# EAGLE design untitled (EAGLE 9.2.2)
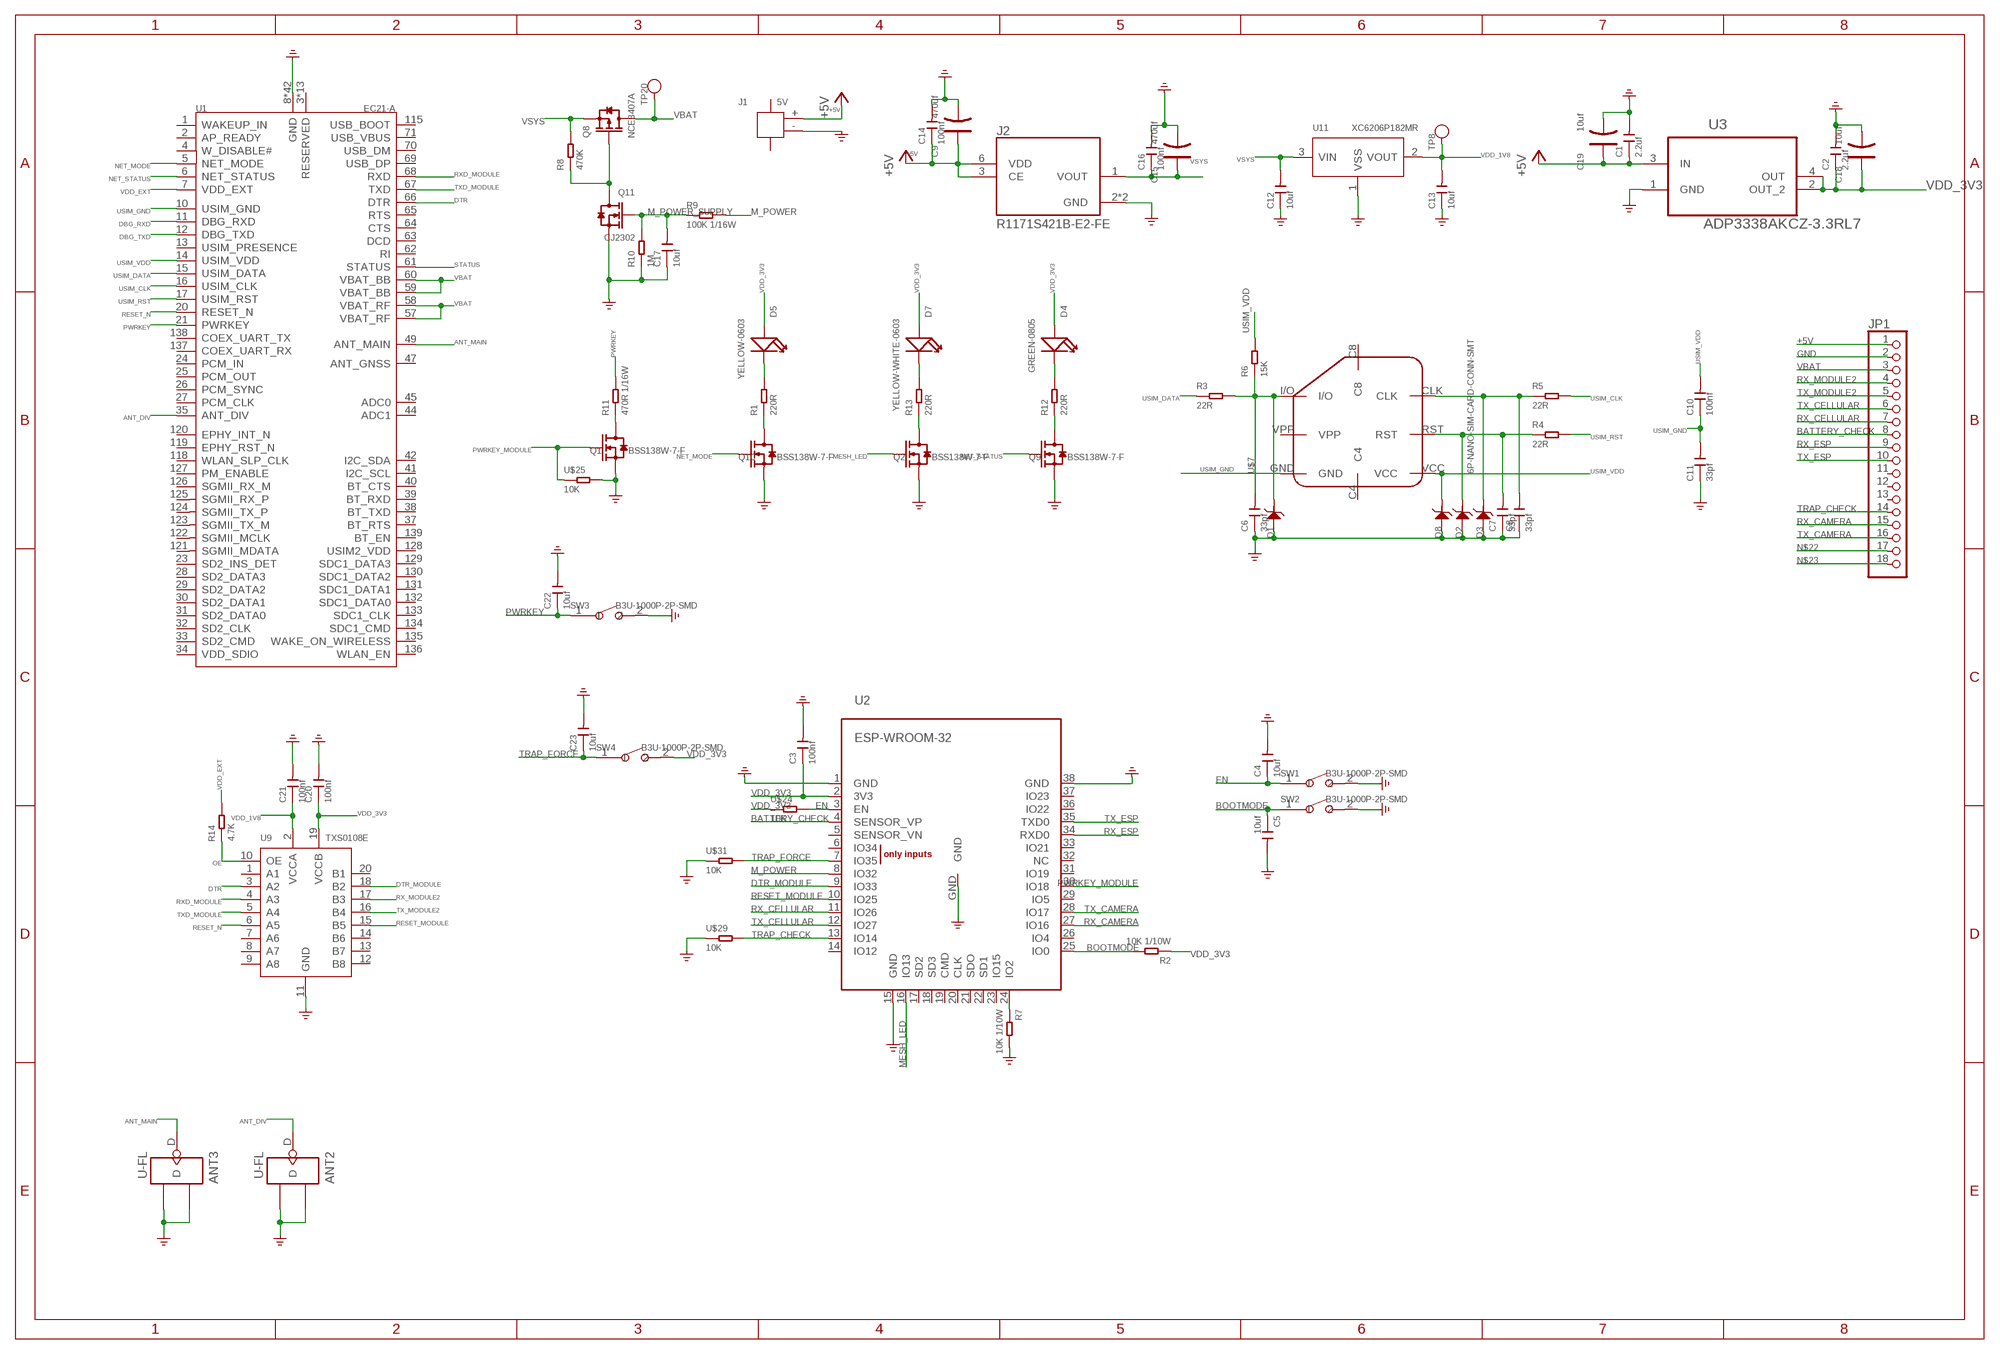
[diagram p0: schematic, sheet 1]

## Parts
ANT2  U-FL  ANTENNA-CONN-U-FL(3P)  [U-FL3P-SMD-2.6X2.6X1.0MM]
ANT3  U-FL  ANTENNA-CONN-U-FL(3P)  [U-FL3P-SMD-2.6X2.6X1.0MM]
C1  2.2uf  CERAMIC-2.2UF-10V-10%-X7R(0603)  [C0603]
C2  2.2uf  CERAMIC-2.2UF-10V-10%-X7R(0603)  [C0603]
C3  100nf  CERAMIC-100NF-25V-10%-X7R(0402)  [C0402]
C4  10uf  CERAMIC-10UF-10V-10%-X5R(0603)  [C0603]
C5  10uf  CERAMIC-10UF-10V-10%-X5R(0603)  [C0603]
C6  33pf  CERAMIC-33PF-50V-5%-NPO(0402)  [C0402]
C7  33pf  CERAMIC-33PF-50V-5%-NPO(0402)  [C0402]
C8  33pf  CERAMIC-33PF-50V-5%-NPO(0402)  [C0402]
C9  470uf  TANTALUM-SMD-470UF-6.3V(AVX-D)  [AVX-D]
C10  100nf  CERAMIC-100NF-25V-10%-X7R(0402)  [C0402]
C11  33pf  CERAMIC-33PF-50V-5%-NPO(0402)  [C0402]
C12  10uf  CERAMIC-10UF-10V-10%-X5R(0603)  [C0603]
C13  10uf  CERAMIC-10UF-10V-10%-X5R(0603)  [C0603]
C14  100nf  CERAMIC-100NF-25V-10%-X7R(0402)  [C0402]
C15  470uf  TANTALUM-SMD-470UF-6.3V(AVX-D)  [AVX-D]
C16  100nf  CERAMIC-100NF-25V-10%-X7R(0402)  [C0402]
C17  10uf  CERAMIC-10UF-6.3V-20%-X5R(0402)  [C0402]
C18  10uf  TANTALUM-SMD-10UF-10V-10%(AVX-A)  [AVX-A]
C19  10uf  TANTALUM-SMD-10UF-10V-10%(AVX-A)  [AVX-A]
C20  100nf  CERAMIC-100NF-25V-10%-X7R(0402)  [C0402]
C21  100nf  CERAMIC-100NF-25V-10%-X7R(0402)  [C0402]
C22  10uf  CERAMIC-10UF-10V-10%-X5R(0603)  [C0603]
C23  10uf  CERAMIC-10UF-10V-10%-X5R(0603)  [C0603]
D1  ESD;DF2S6.8FS  D-ESD-2P'DF2S6.8FS'  [SOD-923]
D2  ESD;DF2S6.8FS  D-ESD-2P'DF2S6.8FS'  [SOD-923]
D3  ESD;DF2S6.8FS  D-ESD-2P'DF2S6.8FS'  [SOD-923]
D4  GREEN-0805  SMD-LED-CLEAR-GREEN(0805)  [LED-0805]
D5  YELLOW-0603  SMD-LED-CLEAR-YELLOW(0603)  [LED-0603]
D7  YELLOW-WHITE-0603  SMD-LED-YELLOW-WHITE(0603)  [LED-0603]
D8  ESD;DF2S6.8FS  D-ESD-2P'DF2S6.8FS'  [SOD-923]
J1  5V  CONN-HEADER-SMD-PH-SIDE-(2P-2.0MM)  [HW2-SMD-2.0-90D]
J2  R1171S421B-E2-FE  [REG_R1171S421B-E2-FE]
JP1  HEADER-1X18  [1X18_ROUND70]
Q1  BSS138W-7-F  SMD-MOSFET-N-CH-50V-200MA-BSS138W-7-F(SOT-23)  [SOT-23]
Q2  BSS138W-7-F  SMD-MOSFET-N-CH-50V-200MA-BSS138W-7-F(SOT-23)  [SOT-23]
Q8  NCE3407A  SMD-MOSFET-P-CH-VDC=30V-ID=4.3A-NCE3407A(SOT-23)  [SOT-23]
Q9  BSS138W-7-F  SMD-MOSFET-N-CH-50V-200MA-BSS138W-7-F(SOT-23)  [SOT-23]
Q10  BSS138W-7-F  SMD-MOSFET-N-CH-50V-200MA-BSS138W-7-F(SOT-23)  [SOT-23]
Q11  CJ2302  SMD-MOSFET-N-CH-20V-2.1A-CJ2302(SOT-23)  [SOT-23]
R1  220R  SMD-RES-220R-5%-1/10W(0603)  [R0603]
R2  10K 1/10W  SMD-RES-10K-5%-1/10W(0603)  [R0603]
R3  22R  SMD-RES-22R-5%-1/10W(0603)  [R0603]
R4  22R  SMD-RES-22R-5%-1/10W(0603)  [R0603]
R5  22R  SMD-RES-22R-5%-1/10W(0603)  [R0603]
R6  15K  SMD-RES-15K-5%-1/10W(0603)  [R0603]
R7  10K 1/10W  SMD-RES-10K-5%-1/10W(0603)  [R0603]
R8  470K  SMD-RES-470K-1%-1/16W(0402)  [R0402]
R9  100K 1/16W  SMD-RES-100K-5%-1/16W(0402)  [R0402]
R10  1M  SMD-RES-1M-5%-1/16W(0402)  [R0402]
R11  470R 1/16W  SMD-RES-470R-5%-1/16W(0402)  [R0402]
R12  220R  SMD-RES-220R-5%-1/10W(0603)  [R0603]
R13  220R  SMD-RES-220R-5%-1/10W(0603)  [R0603]
R14  4.7K  SMD-RES-4.7K-5%-1/16W(0402)  [R0402]
SW1  B3U-1000P-2P-SMD  SMD-BUTTON(2P-3.0X2.5X1.2+0.4MM)-B3U-1000P-2P-SMD  [SW2-2.6-3.0X2.5X1.2+0.4MM]
SW2  B3U-1000P-2P-SMD  SMD-BUTTON(2P-3.0X2.5X1.2+0.4MM)-B3U-1000P-2P-SMD  [SW2-2.6-3.0X2.5X1.2+0.4MM]
SW3  B3U-1000P-2P-SMD  SMD-BUTTON(2P-3.0X2.5X1.2+0.4MM)-B3U-1000P-2P-SMD  [SW2-2.6-3.0X2.5X1.2+0.4MM]
SW4  B3U-1000P-2P-SMD  SMD-BUTTON(2P-3.0X2.5X1.2+0.4MM)-B3U-1000P-2P-SMD  [SW2-2.6-3.0X2.5X1.2+0.4MM]
TP8  TEST-POINT'4545'  [TP-D45MIL]
TP20  TEST-POINT'4545'  [TP-D45MIL]
U1  EC21-A  MOUDLE-LTE-EC21  [MODULE144P-1.3-32X29X2.4MM]
U2  ESP-WROOM-32  [ESP-WROOM-32]
U3  ADP3338AKCZ-3.3RL7  [SOT230P700X180-4N]
U9  TXS0108E  LOGIC-TXS0108EPWR  [TSSOP20-0.65-6.5X4.4MM]
U11  XC6206P182MR  PMIC-XC6206PMR  [SOT-23]
U$7  6P-NANO-SIM-CARD-CONN-SMT  [6PIN-NANO-SIM-SMT]
U$24  10K  SMD-RES-10K-5%-1/(0402)  [R0402]
U$25  10K  SMD-RES-10K-5%-1/(0402)  [R0402]
U$29  10K  SMD-RES-10K-5%-1/(0402)  [R0402]
U$31  10K  SMD-RES-10K-5%-1/(0402)  [R0402]

## Nets
+5V: C1.1 C9.+ C14.1 C19.+ J1.+ J2.3(CE) J2.6(VDD) JP1.1 U3.3(IN)
ANT_DIV: ANT2.D U1.35(ANT_DIV)
ANT_MAIN: ANT3.D U1.49(ANT_MAIN)
BATTERY_CHECK: JP1.8 U2.4(SENSOR_VP)
BOOTMODE: C5.1 R2.2 SW2.1 U2.25(IO0)
DBG_RXD: U1.11(DBG_RXD)
DBG_TXD: U1.12(DBG_TXD)
DTR: U1.66(DTR) U9.3(A2)
DTR_MODULE: U2.9(IO33) U9.18(B2)
EN: C4.1 SW1.1 U2.3(EN) U$24.2
GND: ANT2.GND1 ANT2.GND2 ANT3.GND1 ANT3.GND2 C1.2 C2.2 C3.2 C4.2 C5.2 C6.1 C7.1 C8.1 C9.- C11.1 C12.1 C13.1 C14.2 C15.- C16.2 C17.1 C18.- C19.- C20.2 C21.2 C22.2 C23.2 D1.2 D2.2 D3.2 D8.2 J1.- J2.2(GND) J2.5(GND) JP1.2 Q1.2(S) Q2.2(S) Q9.2(S) Q10.2(S) Q11.2(S) R7.2 R10.1 SW1.2 SW2.2 SW3.2 U1.8(GND) U1.9(GND) U1.19(GND) U1.22(GND) U1.36(GND) U1.46(GND) U1.48(GND) U1.50(GND) U1.51(GND) U1.52(GND) U1.53(GND) U1.54(GND) U1.56(GND) U1.72(GND) U1.85(GND) U1.86(GND) U1.87(GND) U1.88(GND) U1.89(GND) U1.90(GND) U1.91(GND) U1.92(GND) U1.93(GND) U1.94(GND) U1.95(GND) U1.96(GND) U1.97(GND) U1.98(GND) U1.99(GND) U1.100(GND) U1.101(GND) U1.102(GND) U1.103(GND) U1.104(GND) U1.105(GND) U1.106(GND) U1.107(GND) U1.108(GND) U1.109(GND) U1.110(GND) U1.111(GND) U1.112(GND) U2.1(GND) U2.15(GND) U2.38(GND) U2.GND U3.1(GND) U9.11(GND) U11.1(VSS) U$25.2 U$29.1 U$31.1 ; supply symbol labelled GND_POWER
M_POWER: R9.2 U2.8(IO32)
M_POWER_SUPPLY: C17.2 Q11.1(G) R9.1 R10.2
MESH_LED: Q2.1(G) U2.16(IO13)
N$1: C8.2 D3.1 R5.1 U$7.CLK
N$2: C7.2 D2.1 R4.1 U$7.RST
N$3: Q10.3(D) R1.1
N$4: C6.2 D1.1 R3.2 R6.1 U$7.I/O
N$5: Q1.3(D) R11.1
N$6: D5.- R1.2
N$7: R7.1 U2.24(IO2)
N$8: Q9.3(D) R12.1
N$9: D4.- R12.2
N$10: Q2.3(D) R13.1
N$11: D7.- R13.2
N$22: JP1.17
N$23: JP1.18
N$25: Q8.1(G) Q11.3(D) R8.1
NET_MODE: Q10.1(G) U1.5(NET_MODE)
NET_STATUS: Q9.1(G) U1.6(NET_STATUS)
OE: R14.1 U9.10(OE)
PWRKEY: C22.1 R11.2 SW3.1 U1.21(PWRKEY)
PWRKEY_MODULE: Q1.1(G) U2.30(IO18) U$25.1
RESET_MODULE: U2.10(IO25) U9.15(B5)
RESET_N: U1.20(RESET_N) U9.6(A5)
RX_CAMERA: JP1.15 U2.27(IO16)
RX_CELLULAR: JP1.7 U2.11(IO26)
RX_ESP: JP1.9 U2.34(RXD0)
RX_MODULE2: JP1.4 U9.17(B3)
RXD_MODULE: U1.68(RXD) U9.4(A3)
STATUS: U1.61(STATUS)
TRAP_CHECK: JP1.14 U2.13(IO14) U$29.2
TRAP_FORCE: C23.1 SW4.1 U2.7(IO35) U$31.2
TX_CAMERA: JP1.16 U2.28(IO17)
TX_CELLULAR: JP1.6 U2.12(IO27)
TX_ESP: JP1.10 U2.35(TXD0)
TX_MODULE2: JP1.5 U9.16(B4)
TXD_MODULE: U1.67(TXD) U9.5(A4)
USIM_CLK: R5.2 U1.16(USIM_CLK)
USIM_DATA: R3.1 U1.15(USIM_DATA)
USIM_GND: C10.1 C11.2 U1.10(USIM_GND) U$7.GND
USIM_RST: R4.2 U1.17(USIM_RST)
USIM_VDD: C10.2 D8.1 R6.2 U1.14(USIM_VDD) U$7.VCC
VBAT: JP1.3 Q8.3(D) TP20.T U1.57(VBAT_RF) U1.58(VBAT_RF) U1.59(VBAT_BB) U1.60(VBAT_BB)
VDD_1V8: C13.2 C21.1 TP8.T U9.2(VCCA) U11.2(VOUT)
VDD_3V3: C2.1 C3.1 C18.+ C20.1 D4.+ D5.+ D7.+ R2.1 SW4.2 U2.2(3V3) U3.2(OUT_2) U3.4(OUT) U9.19(VCCB) U$24.1
VDD_EXT: R14.2 U1.7(VDD_EXT)
VSYS: C12.2 C15.+ C16.1 J2.1(VOUT) Q8.2(S) R8.2 U11.3(VIN)
Unconnected: J1.3 J1.4 JP1.11 JP1.12 JP1.13 U1.1(WAKEUP_IN) U1.2(AP_READY) U1.3(RESERVED) U1.4(W_DISABLE#) U1.13(USIM_PRESENCE) U1.18(RESERVED) U1.23(SD2_INS_DET) U1.24(PCM_IN) U1.25(PCM_OUT) U1.26(PCM_SYNC) U1.27(PCM_CLK) U1.28(SD2_DATA3) U1.29(SD2_DATA2) U1.30(SD2_DATA1) U1.31(SD2_DATA0) U1.32(SD2_CLK) U1.33(SD2_CMD) U1.34(VDD_SDIO) U1.37(BT_RTS) U1.38(BT_TXD) U1.39(BT_RXD) U1.40(BT_CTS) U1.41(I2C_SCL) U1.42(I2C_SDA) U1.43(RESERVED) U1.44(ADC1) U1.45(ADC0) U1.47(ANT_GNSS) U1.55(RESERVED) U1.62(RI) U1.63(DCD) U1.64(CTS) U1.65(RTS) U1.69(USB_DP) U1.70(USB_DM) U1.71(USB_VBUS) U1.113(RESERVED) U1.114(RESERVED) U1.115(USB_BOOT) U1.116(RESERVED) U1.117(RESERVED) U1.118(WLAN_SLP_CLK) U1.119(EPHY_RST_N) U1.120(EPHY_INT_N) U1.121(SGMII_MDATA) U1.122(SGMII_MCLK) U1.123(SGMII_TX_M) U1.124(SGMII_TX_P) U1.125(SGMII_RX_P) U1.126(SGMII_RX_M) U1.127(PM_ENABLE) U1.128(USIM2_VDD) U1.129(SDC1_DATA3) U1.130(SDC1_DATA2) U1.131(SDC1_DATA1) U1.132(SDC1_DATA0) U1.133(SDC1_CLK) U1.134(SDC1_CMD) U1.135(WAKE_ON_WIRELESS) U1.136(WLAN_EN) U1.137(COEX_UART_RX) U1.138(COEX_UART_TX) U1.139(BT_EN) U1.140(RESERVED) U1.141(RESERVED) U1.142(RESERVED) U1.143(RESERVED) U1.144(RESERVED) U2.5(SENSOR_VN) U2.6(IO34) U2.14(IO12) U2.17(SD2) U2.18(SD3) U2.19(CMD) U2.20(CLK) U2.21(SDO) U2.22(SD1) U2.23(IO15) U2.26(IO4) U2.29(IO5) U2.31(IO19) U2.32(NC) U2.33(IO21) U2.36(IO22) U2.37(IO23) U9.1(A1) U9.7(A6) U9.8(A7) U9.9(A8) U9.12(B8) U9.13(B7) U9.14(B6) U9.20(B1) U$7.C4 U$7.C8 U$7.VPP

## Library data of the parts
ANT2 ANT3 = Seeed-Connector:ANTENNA-CONN-U-FL(3P): 320110048
C1 C2 = Seeed-Capacitor:CERAMIC-2.2UF-10V-10%-X7R(0603): 302010054; MPN: CC0603KRX7R6BB225
C3 C10 C14 C16 C20 C21 = Seeed-Capacitor:CERAMIC-100NF-25V-10%-X7R(0402): 302010024; MPN: CC0402KRX7R8BB104
C4 C5 C12 C13 C22 C23 = Seeed-Capacitor:CERAMIC-10UF-10V-10%-X5R(0603): 302010103; MPN: CC0603KRX5R6BB106
C6-C8 C11 = Seeed-Capacitor:CERAMIC-33PF-50V-5%-NPO(0402): 302010000; MPN: CC0402JRNPO9BN330
C9 C15 = Seeed-Capacitor:TANTALUM-SMD-470UF-6.3V(AVX-D): 302020027; MPN: TAJD477*006#NJ
C17 = Seeed-Capacitor:CERAMIC-10UF-6.3V-20%-X5R(0402): 302010053; MPN: CC0402MRX5R5BB106
C18 C19 = Seeed-Capacitor:TANTALUM-SMD-10UF-10V-10%(AVX-A): 302020011; MPN: TAJA106K010RNJ
D1-D3 D8 = Discrete-new:D-ESD-2P: SOD-923:304060009;SOD-123:304060001
D4 = Seeed-LED:SMD-LED-CLEAR-GREEN(0805): 304090057; MPN: 17-215SYGC/S530-E2/TR8
D5 = Seeed-LED:SMD-LED-CLEAR-YELLOW(0603): 304090044; MPN: 19-217-Y5C-AM1N1VY-3T
D7 = Seeed-LED:SMD-LED-YELLOW-WHITE(0603): 304090071; MPN: ADL-0603W
J1 = Seeed-Connector:CONN-HEADER-SMD-PH-SIDE-(2P-2.0MM): 320110026; VALUE: 2P-2.0-90D-SMD
J2 = R1171S421B-E2-FE:R1171S421B-E2-FE: R1171x SERIES, 2.0A/1.5A LDO REUGULATOR; AVAILABILITY: Unavailable; MF: Ricoh; MP: R1171S421B-E2-FE; PACKAGE: None; PRICE: None
JP1 = microbuilder:HEADER-1X18: Header 1x18
Q1 Q2 Q9 Q10 = Seeed-Transistor:SMD-MOSFET-N-CH-50V-200MA-BSS138W-7-F(SOT-23): 305030000; MPN: BSS138W-7-F
Q8 = Seeed-Transistor:SMD-MOSFET-P-CH-VDC=30V-ID=4.3A-NCE3407A(SOT-23): 305030010; MPN: NCE3407A
Q11 = Seeed-Transistor:SMD-MOSFET-N-CH-20V-2.1A-CJ2302(SOT-23): 305030015; MPN: CJ2302
R1 R12 R13 = Seeed-Resistor:SMD-RES-220R-5%-1/10W(0603): 301010163; MPN: RC0603JR-07220RL
R2 R7 = Seeed-Resistor:SMD-RES-10K-5%-1/10W(0603): 301010293; MPN: RC0603JR-0710KL
R3-R5 = Seeed-Resistor:SMD-RES-22R-5%-1/10W(0603): 301010289; MPN: RC0603JR-0722RL
R6 = Seeed-Resistor:SMD-RES-15K-5%-1/10W(0603): 301010103; MPN: RC0603JR-0715KL
R8 = Seeed-Resistor:SMD-RES-470K-1%-1/16W(0402): 301010069; MPN: RC0402FR-07470KL
R9 = Seeed-Resistor:SMD-RES-100K-5%-1/16W(0402): 301010033; MPN: RC0402JR-07100KL
R10 = Seeed-Resistor:SMD-RES-1M-5%-1/16W(0402): 301010009; MPN: RC0402JR-071ML
R11 = Seeed-Resistor:SMD-RES-470R-5%-1/16W(0402): 301010013; MPN: RC0402JR-07470RL
R14 = Seeed-Resistor:SMD-RES-4.7K-5%-1/16W(0402): 301010010; MPN: RC0402JR-074K7L
SW1-SW4 = Seeed-Switch:SMD-BUTTON(2P-3.0X2.5X1.2+0.4MM): 311020047; MPN: B3U-1000P-2P-SMD
TP8 TP20 = Discrete-new:TEST-POINT; PARTNO: DNP
U1 = moudle-new:MOUDLE-LTE-EC21
U2 = esp32:ESP-WROOM-32
U3 = ADP3338AKCZ-3.3RL7:ADP3338AKCZ-3.3RL7: Low Dropout Regulator; AVAILABILITY: Unavailable; DESCRIPTION: LDO Regulator Pos 3.3V 1.6A 4-Pin_3+Tab_ SOT-223 T/R; MF: Analog Devices; MP: ADP3338AKCZ-3.3RL7; PACKAGE: SOT-223 Analog Devices; PRICE: None
U9 = IC-new:LOGIC-TXS0108EPWR: 310050026
U11 = IC-new:PMIC-XC6206P: LOW ESR Cap.Compatible Positive Voltage Regulators
U$7 = Seeed-OPL-2017-01-connector-edward:6P-NANO-SIM-CARD-CONN-SMT: 320100008
U$24 U$25 U$29 U$31 = Seeed-Resistor:SMD-RES-10K-5%-1/(0402): 301010004; MPN: RC0402JR-0710KL

## Board
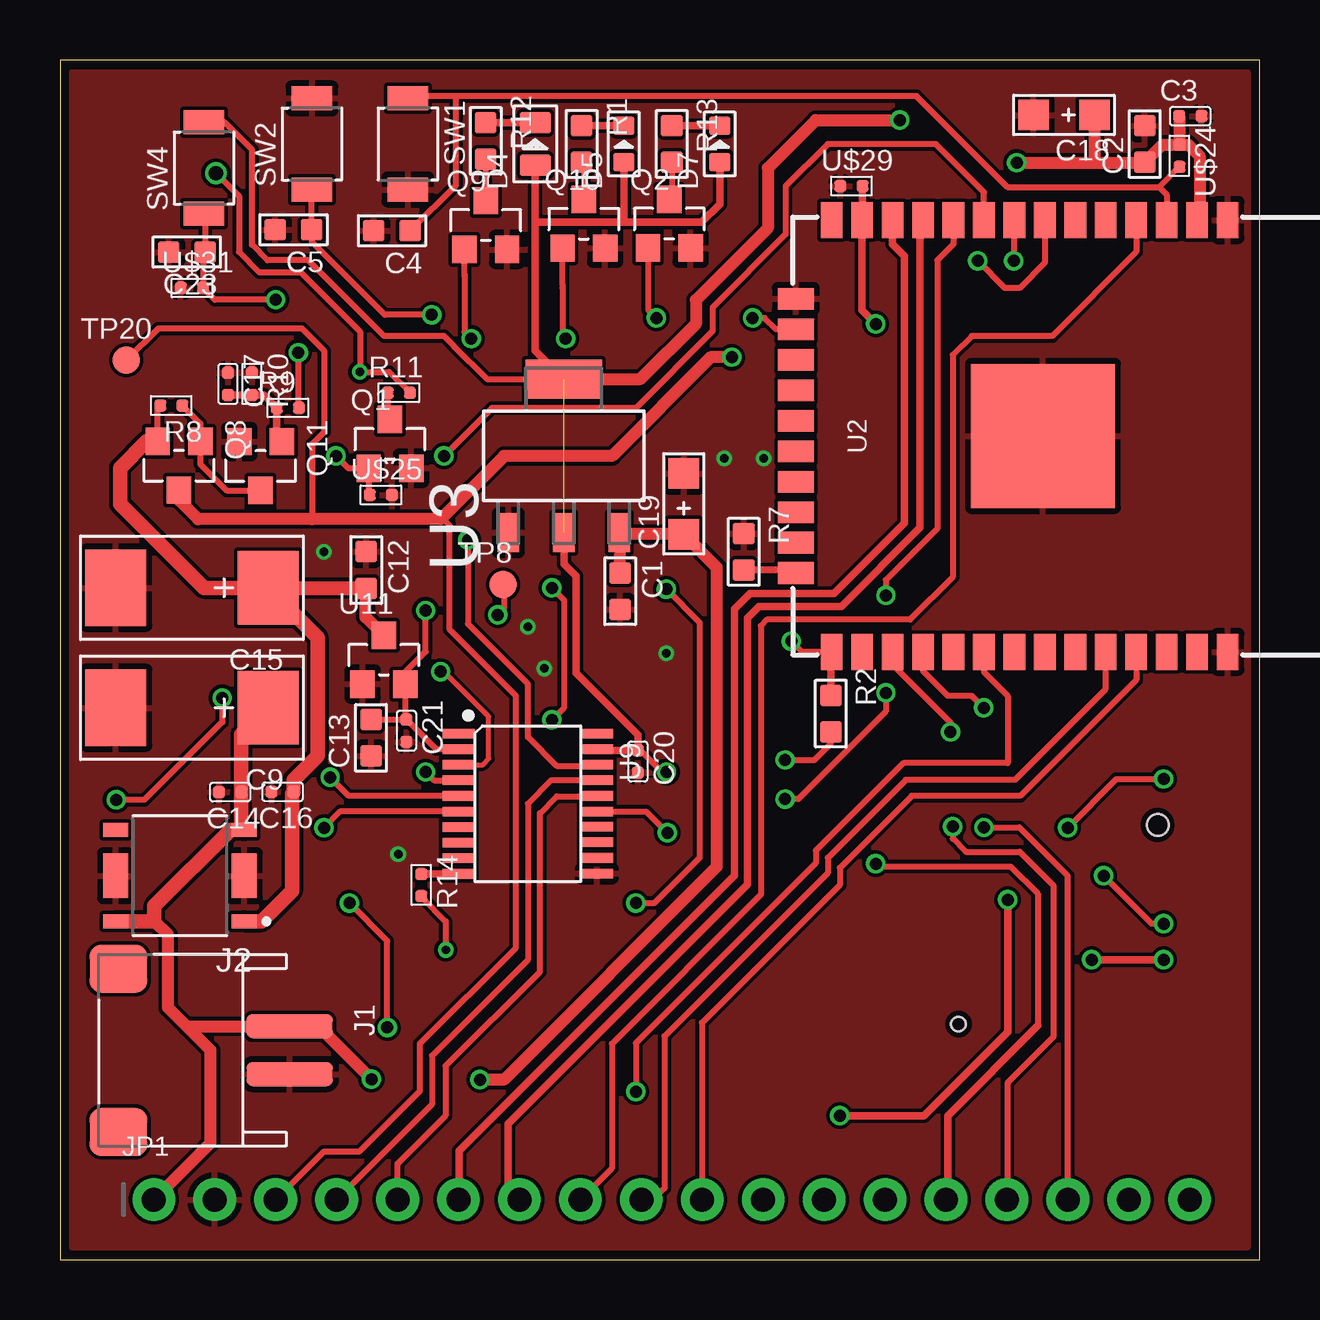
[diagram p1: board, top side]
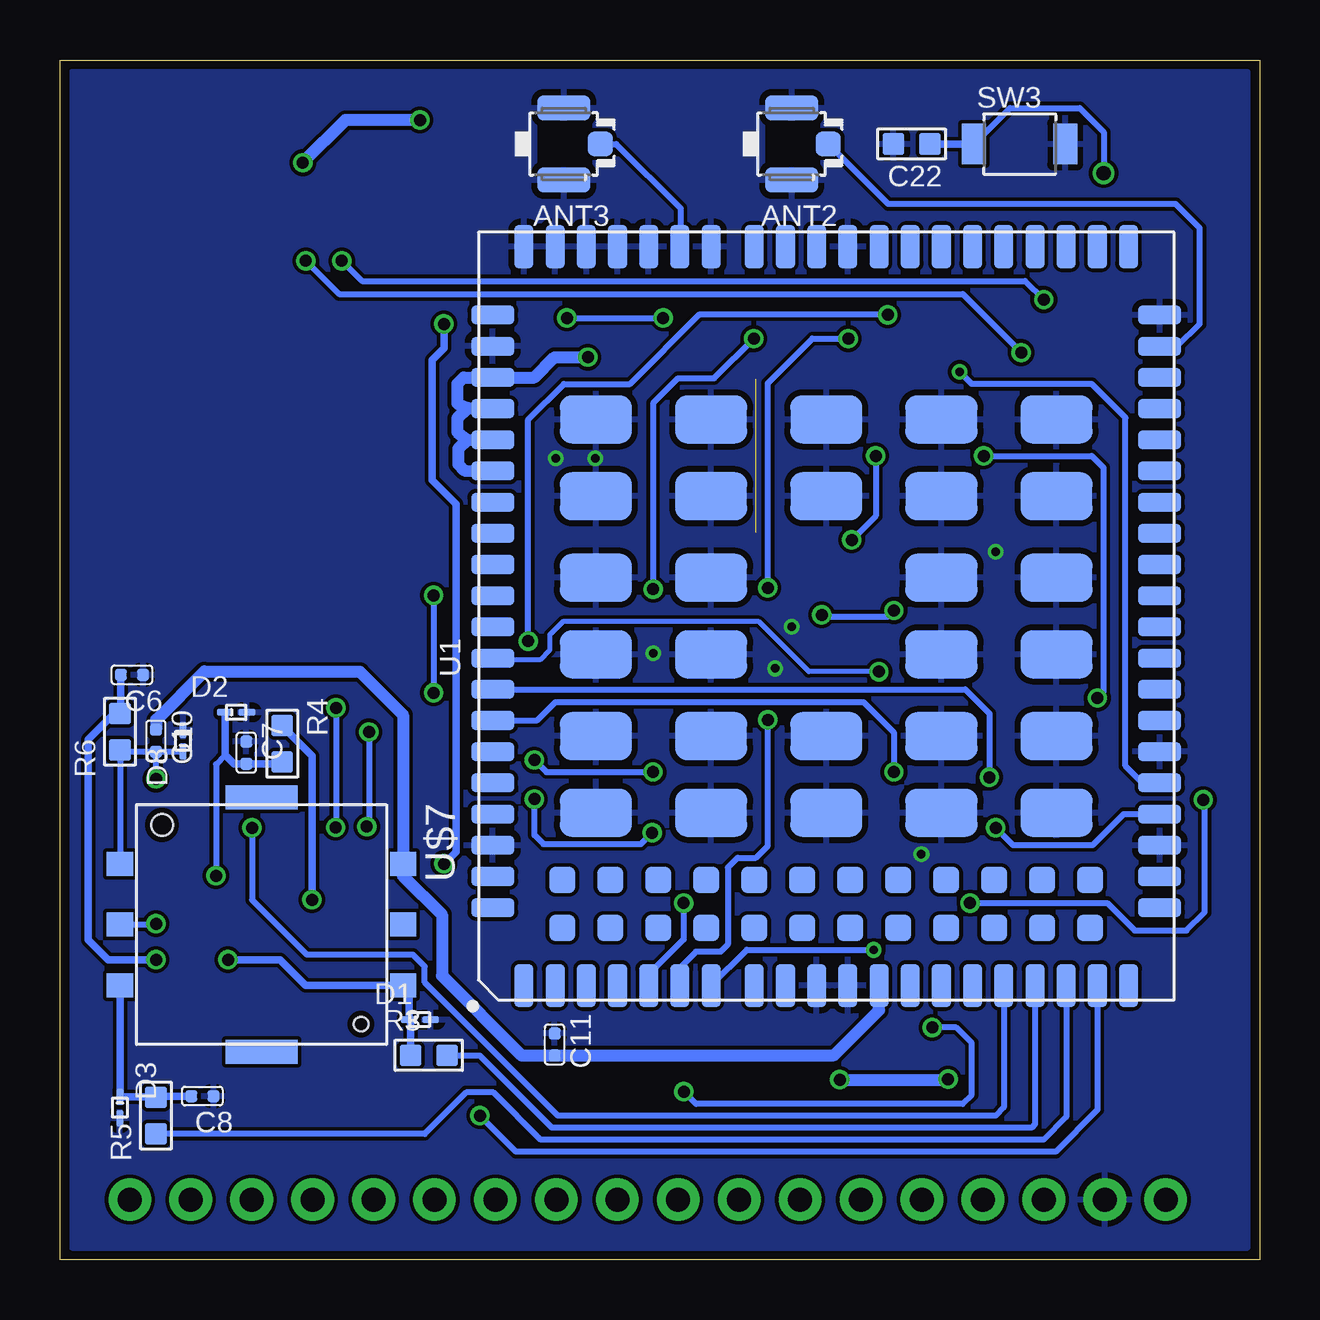
[diagram p2: board, bottom side, seen from below]

Size 50 x 50 mm. Coordinates in mm from the lower left corner, seen from the top.
Outline: 0,0 50,0 50,50 0,50 0,0
Copper layers (1*16): Top 0.035mm / dielectric 1.5mm / Bottom 0.035mm
Design rules "SeeedStudio_2layer_DRU_no_angle_20140221": minimum track width 6mil, minimum drill 12mil, track to track 6mil, track to pad 6mil, pad to pad 6mil, via to via 6mil, smd to smd 0mil, copper to edge 10mil, drill to drill 10mil, minimum pad ring 10mil, minimum via ring 6mil, stop-mask expansion 2mil, vias tented up to drill 100mil, thermal gap 10mil

### Footprints (pad centres in the part's own frame; a part is rotated, then mirrored left to right if it is on the bottom)
U-FL3P-SMD-2.6X2.6X1.0MM = smd 1.05 x 1: D -1.524,0 | smd 2.2 x 1.05: GND1 0,1.5; GND2 0,-1.5
C0603 = smd 0.889 x 0.889: 1 0,0.762; 2 0,-0.762
C0402 = smd 0.5 x 0.5: 1 0,0.463; 2 0,-0.463
AVX-D = smd 2.54 x 3.048: + -3.175,0 | smd 2.54 x 3.175: - 3.175,0
AVX-A = smd 1.27 x 1.27: + -1.27,0; - 1.27,0
SOD-923 = smd 0.7 x 0.3: 1 -0.45,0; 2 0.45,0
LED-0805 = smd 0.889 x 1.27: + -0.889,0; - 0.889,0
LED-0603 = smd 0.762 x 0.889: + -0.762,0; - 0.762,0
HW2-SMD-2.0-90D = smd 2 x 2.4: 3 3.4,-2.181; 4 -3.4,-2.181 | smd 1 x 3.6: + -1,4.953; - 1,4.953
REG_R1171S421B-E2-FE = smd 1.05 x 0.6: 1 -2.675,1.905; 3 -2.675,-1.905; 4 2.675,-1.905; 6 2.675,1.905 | smd 1.05 x 1.87: 2 -2.675,0; 5 2.675,0
1X18_ROUND70 = drill 1 pad 1.778: 1 -21.59,0; 2 -19.05,0; 3 -16.51,0; 4 -13.97,0; 5 -11.43,0; 6 -8.89,0; 7 -6.35,0; 8 -3.81,0; 9 -1.27,0; 10 1.27,0; 11 3.81,0; 12 6.35,0; 13 8.89,0; 14 11.43,0; 15 13.97,0; 16 16.51,0; 17 19.05,0; 18 21.59,0
SOT-23 = smd 1.016 x 1.143: 1 -0.889,-1.016; 2 0.889,-1.016; 3 0,1.016
R0603 = smd 0.889 x 0.889: 1 0,0.762; 2 0,-0.762
R0402 = smd 0.5 x 0.5: 1 0,0.463; 2 0,-0.463
SW2-2.6-3.0X2.5X1.2+0.4MM = smd 1 x 1.7: 1 -1.9,0; 2 1.9,0
TP-D45MIL = smd 1.143 x 1.143: T 0,0
MODULE144P-1.3-32X29X2.4MM = smd 1.8 x 0.8: 1 -15.4,12.6; 2 -15.4,11.3; 3 -15.4,10; 4 -15.4,8.7; 5 -15.4,7.4; 6 -15.4,6.1; 7 -15.4,4.8; 8 -15.4,0.4; 9 -15.4,-0.9; 10 -15.4,-2.2; 11 -15.4,-3.5; 12 -15.4,-4.8; 13 -15.4,-6.1; 14 -15.4,-7.4; 15 -15.4,-8.7; 16 -15.4,-10; 17 -15.4,-11.3; 18 -15.4,-12.6; 37 15.4,-12.6; 38 15.4,-11.3; 39 15.4,-10; 40 15.4,-8.7; 41 15.4,-7.4; 42 15.4,-6.1; 43 15.4,-4.8; 44 15.4,-3.5; 45 15.4,-2.2; 46 15.4,-0.9; 47 15.4,0.4; 48 15.4,4.8; 49 15.4,6.1; 50 15.4,7.4; 51 15.4,8.7; 52 15.4,10; 53 15.4,11.3; 54 15.4,12.6; 141 -15.4,3; 142 -15.4,1.7; 143 15.4,1.7; 144 15.4,3 | smd 0.8 x 1.8: 19 -9.55,-13.9; 20 -8.25,-13.9; 21 -6.95,-13.9; 22 -5.65,-13.9; 23 -4.35,-13.9; 24 -3.05,-13.9; 25 -1.75,-13.9; 26 -0.45,-13.9; 27 0.85,-13.9; 28 2.15,-13.9; 29 3.45,-13.9; 30 4.75,-13.9; 31 6.05,-13.9; 32 7.35,-13.9; 33 8.65,-13.9; 34 9.95,-13.9; 35 11.25,-13.9; 36 12.55,-13.9; 55 12.55,13.9; 56 11.25,13.9; 57 9.95,13.9; 58 8.65,13.9; 59 7.35,13.9; 60 6.05,13.9; 61 4.75,13.9; 62 3.45,13.9; 63 2.15,13.9; 64 0.85,13.9; 65 -0.45,13.9; 66 -1.75,13.9; 67 -3.05,13.9; 68 -4.35,13.9; 69 -5.65,13.9; 70 -6.95,13.9; 71 -8.25,13.9; 72 -9.55,13.9; 113 -10.85,13.9; 114 -12.15,13.9; 115 -10.85,-13.9; 116 -12.15,-13.9 | smd 2 x 3: 85 8.2,9.6; 86 8.2,4.8; 87 8.2,0; 88 8.2,-4.8; 89 8.2,-9.6; 90 5,9.6; 91 5,4.8; 92 5,0; 93 5,-4.8; 94 5,-9.6; 95 1.6,9.6; 96 1.6,4.8; 97 1.6,-4.8; 98 1.6,-9.6; 99 -1.6,9.6; 100 -1.6,4.8; 101 -1.6,-4.8; 102 -1.6,-9.6; 103 -5,9.6; 104 -5,4.8; 105 -5,0; 106 -5,-4.8; 107 -5,-9.6; 108 -8.2,9.6; 109 -8.2,4.8; 110 -8.2,0; 111 -8.2,-4.8; 112 -8.2,-9.6 | smd 1.1 x 1.1: 117 -11,11; 118 -11,9; 119 -11,7; 120 -11,5; 121 -11,3; 122 -11,1; 123 -11,-1; 124 -11,-3; 125 -11,-5; 126 -11,-7; 127 -11,-9; 128 -11,-11; 129 -13,11; 130 -13,9; 131 -13,7; 132 -13,5; 133 -13,3; 134 -13,1; 135 -13,-1; 136 -13,-3; 137 -13,-5; 138 -13,-7; 139 -13,-9; 140 -13,-11
ESP-WROOM-32 = smd 0.9 x 1.5: 1 7.7,9; 2 6.43,9; 3 5.16,9; 4 3.89,9; 5 2.62,9; 6 1.35,9; 7 0.08,9; 8 -1.19,9; 9 -2.46,9; 10 -3.73,9; 11 -5,9; 12 -6.27,9; 13 -7.54,9; 14 -8.81,9; 25 -8.81,-9; 26 -7.54,-9; 27 -6.27,-9; 28 -5,-9; 29 -3.73,-9; 30 -2.46,-9; 31 -1.19,-9; 32 0.08,-9; 33 1.35,-9; 34 2.62,-9; 35 3.89,-9; 36 5.16,-9; 37 6.43,-9; 38 7.7,-9 | smd 1.5 x 0.9: 15 -10.3,5.715; 16 -10.3,4.445; 17 -10.3,3.175; 18 -10.3,1.905; 19 -10.3,0.635; 20 -10.3,-0.635; 21 -10.3,-1.905; 22 -10.3,-3.175; 23 -10.3,-4.445; 24 -10.3,-5.715 | smd 6 x 6: GND 0,0
SOT230P700X180-4N = smd 1.626 x 0.889: 1 -3.2,2.311; 2 -3.2,0; 3 -3.2,-2.311 | smd 1.626 x 3.175: 4 3.2,0
TSSOP20-0.65-6.5X4.4MM = smd 0.4 x 1.35: 1 -2.925,-2.875; 2 -2.275,-2.875; 3 -1.625,-2.875; 4 -0.975,-2.875; 5 -0.325,-2.875; 6 0.325,-2.875; 7 0.975,-2.875; 8 1.625,-2.875; 9 2.275,-2.875; 10 2.925,-2.875; 11 2.91,2.875; 12 2.26,2.875; 13 1.61,2.875; 14 0.96,2.875; 15 0.325,2.875; 16 -0.325,2.875; 17 -0.975,2.875; 18 -1.625,2.875; 19 -2.275,2.875; 20 -2.925,2.875
6PIN-NANO-SIM-SMT = smd 1 x 3: C4 -2.765,5.9; C8 7.845,5.9 | smd 1 x 1.1: CLK 5.08,0; GND 0,11.8; I/O 5.08,11.8; RST 2.54,0; VCC 0,0; VPP 2.54,11.8 | hole 0.9: -1.61,1.75 | hole 0.6: 6.69,10.05

### Placement (x,y rotation side)
ANT2  19.5,46.5 180 bottom
ANT3  29,46.5 180 bottom
C1  23.35,27.86 0 top
C2  45.22,46.49 180 top
C3  47.11,47.66 90 top
C4  13.84,42.88 270 top
C5  9.73,42.93 270 top
C6  47,24.37 270 bottom
C7  42.24,21.13 0 bottom
C8  44.07,6.81 270 bottom
C9  5.5,23 180 top
C10  46,21.63 0 bottom
C11  29.39,8.96 0 bottom
C12  12.77,28.74 0 top
C13  12.96,21.75 180 top
C14  7.09,19.48 270 top
C15  5.5,28 180 top
C16  9.28,19.5 270 top
C17  7,36.5 0 top
C18  41.85,47.71 180 top
C19  26,31.5 90 top
C20  24.09,20.76 0 top
C21  14.44,22.04 0 top
C22  14.5,46.5 270 bottom
C23  5.29,42 270 top
D1  35,10 0 bottom
D2  42.66,22.81 0 bottom
D3  47.51,6.33 270 bottom
D4  19.81,46.5 90 top
D5  23.5,46.5 90 top
D7  27.5,46.5 90 top
D8  44.87,21.63 90 bottom
J1  4.62,8.72 270 top
J2  5,16 180 top
JP1  25.5,2.5 0 top
Q1  13.75,34 0 top
Q2  25.4,43.18 0 top
Q8  4.96,33.09 180 top
Q9  17.75,43.12 0 top
Q10  21.84,43.17 0 top
Q11  8.36,33.08 180 top
R1  21.75,46.5 180 top
R2  32.13,22.75 180 top
R3  34.63,8.51 270 bottom
R4  40.74,21.5 180 bottom
R5  46,6 0 bottom
R6  47.5,22 0 bottom
R7  28.5,29.5 180 top
R8  4.64,35.6 270 top
R9  9.5,35.5 90 top
R10  8,36.5 0 top
R11  14.13,36.13 90 top
R12  17.75,46.63 180 top
R13  25.5,46.5 180 top
R14  15.05,15.61 0 top
SW1  14.5,46.5 270 top
SW2  10.5,46.5 90 top
SW3  10,46.5 0 bottom
SW4  6,45.5 90 top
TP8  18.47,28.14 0 top
TP20  2.77,37.48 0 top
U1  18.06,26.82 90 bottom
U2  40.97,34.33 0 top
U3  21,33.5 90 top
U9  19.5,19 270 top
U11  13.5,25 0 top
U$7  47.5,16.5 270 bottom
U$24  46.66,46.01 0 top
U$25  13.37,31.87 90 top
U$29  32.99,44.74 90 top
U$31  5.5,40.5 90 top

### Tracks (layer width: path | path; a pad name or v marks a point on that pad's centre or on a via)
+5V  (via drill 0.5)
  Top 0.152: 23.62,30.33 U3.3 | 25.76,30.33 C19.+
  Top 0.508: 5.28,9.72 J1.+ 10.78,9.72 v12.98,7.52 | 5.28,9.72 6.28,8.72 6.28,4.87 JP1.1 | 5.28,9.72 4.5,10.5 4.5,13.53 3.94,14.1 | C1.1 23.37,30.24 | 23.37,30.24 U3.3 | v17.5,7.5 18.51,7.5 27.37,16.36 27.37,28.86 C19.+ 23.38,30.23 23.37,30.24
  Top 0.61: 9.31,9.72 J1.+ | J2.6 3.94,14.1 3.94,14.73 7.11,17.91 7.56,17.91 | 7.56,17.91 J2.3 | 7.56,17.91 C14.1 7.56,21.88 C9.+
  Bottom 0.508: v17.5,7.5 13,7.5 v12.98,7.52
ANT_DIV
  Bottom 0.254: U1.35 3.43,38.07 2.5,39 2.5,43 3.5,44 15.48,44 ANT2.D
ANT_MAIN
  Bottom 0.254: ANT3.D 26.82,46.5 24.13,43.81 24.13,42.25 U1.49
BATTERY_CHECK
  Top 0.254: JP1.8 23,3.81 23,9 29.21,15.21 29.21,26.42 29.46,26.67 35.43,26.67 37.21,28.45 37.21,37.71 38,38.5 41.36,38.5 44.86,42 U2.4
BOOTMODE  (via drill 0.5)
  Top 0.254: U2.25 30.92,25.33 v30.48,25.77 | v15.49,39.38 13.54,39.38 10.49,42.43 C5.1 SW2.1
  Top 0.305: SW2.1 | U2.25 32.13,25.3 R2.2
  Bottom 0.254: v30.48,25.77 30.48,35.02 29,36.5 26.24,36.5 23.34,39.4 15.52,39.4 v15.49,39.38
DTR  (via drill 0.5)
  Top 0.2: U9.3 17.62,20.62 17.87,20.87 17.87,22.63 16,24.5 v15.87,24.5
  Bottom 0.2: v15.87,24.5 18.79,24.5 20.87,26.59 29.04,26.59 29.59,26.04 29.59,25.41 30,25 31.89,25 arc90 U1.66
DTR_MODULE  (via drill 0.5)
  Top 0.254: U2.9 38.51,44.49 36.5,46.5 32,46.5 30.25,44.75 30.25,42.74 27.2,39.68 27.2,38.7 24,35.5 18,35.5 v16,33.5 | U9.18 22.43,20.57 20.7,20.57 19.5,21.77 19.5,24 17,26.5 v17,30
  Bottom 0.254: v16,33.5 16,31 v17,30
EN
  Top 0.254: 45.82,44.7 39.5,44.7 35.7,48.5 16.5,48.5 | U$24.2 45.82,44.7 | 45.82,44.7 46.13,44.39 U2.3 | SW1.1 14.6,48.5 16.5,48.5 | C4.1 16.5,44.78 16.5,48.5
GND  (via drill 0.35)
  Top 0.152: 38.25,31.7 40.84,34.29 U2.GND | 31.09,39.93 30.79,39.93 U2.15 | 22.25,16 U9.11 | 7.62,15.85 J2.2 | 2.29,15.85 J2.5 2.29,16 2.29,16.76 | 13.11,21.03 C13.1 | 14.17,33.22 14.39,32.98 | 5.03,40.45 U$31.1 | 6.86,37.08 C17.1 | 18.9,30.48 18.75,30.33 U3.1
  Bottom 0.152: D2.2 42.17,22.82 D2.2
  other vias: 11,29.5 19.5,26.37 25.27,25.27 20.19,24.64 29.34,33.4 27.69,33.4 14.1,16.89
  pour Top: 0.5,0.5 0.5,49.5 49.5,49.5 49.5,0.5
  pour Bottom: 0.5,0.5 0.5,49.5 49.5,49.5 49.5,0.5
M_POWER  (via drill 0.5)
  Top 0.254: v39.75,41.63 39.78,41.65 U2.8 | v9.93,37.8 9.93,35.53 R9.2
  Bottom 0.254: v9.93,37.8 12.37,40.25 38.37,40.25 v39.75,41.63
M_POWER_SUPPLY
  Top 0.305: Q11.1 9.04,34.35 R9.1 8.5,36.04 R10.2 C17.2
MESH_LED  (via drill 0.5)
  Top 0.254: U2.16 29.84,38.77 29.37,39.25 v28.87,39.25 | v24.86,39.25 24.51,39.59 Q2.1
  Bottom 0.254: v28.87,39.25 v24.86,39.25
N$1
  Bottom 0.305: 47.5,6.79 D3.1 | 47.5,6.79 U$7.CLK | 47.5,6.79 46.03,6.79 R5.1 45.95,6.81 C8.2
N$2  (via drill 0.5)
  Top 0.254: v46,14 45.5,14 v43.5,16
  Bottom 0.254: U$7.RST 46.04,13.96 v46,14 | v43.5,16 43.5,20.64 43.11,21.04
  Bottom 0.305: R4.1 40.81,20.66 C7.2 42.74,20.66 43.11,21.04 D2.1
N$3
  Top 0.254: R1.1 21.84,45.65 Q10.3
N$4  (via drill 0.5)
  Top 0.305: v46,12.5 v43,12.5
  Bottom 0.305: 47.4,22.87 R6.1 | C6.2 47.46,22.8 R6.1 | R3.2 35.4,9.95 D1.1 35.45,11.17 U$7.I/O 39.75,11.43 40.82,12.5 v43,12.5 | R6.1 47.74,22.76 48.83,21.67 48.83,13.33 48,12.5 v46,12.5
N$5
  Top 0.254: 13.54,35.23 Q1.3 13.66,35.1 R11.1
N$6
  Top 0.305: R1.2 D5.-
N$7
  Top 0.305: R7.1 30.51,28.77 U2.24
N$8
  Top 0.254: R12.1 Q9.3
N$9
  Top 0.305: R12.2 D4.-
N$10
  Top 0.254: R13.1 25.5,44.3 Q2.3
N$11
  Top 0.305: R13.2 D7.-
N$25
  Top 0.254: Q11.3 6.94,32.06 5.85,33.15 Q8.1 5.85,34.85 R8.1
NET_MODE  (via drill 0.5)
  Top 0.254: v25.27,27.94 26.66,26.55 26.66,16.75 24.77,14.86 v24,14.86 | v21.08,38.39 20.95,38.52 20.95,40.5 20.95,40.66 Q10.1
  Bottom 0.254: v25.27,27.94 25.27,35.7 24.23,36.73 22.73,36.73 v21.08,38.39 | U1.5 25.46,11.88 24,13.34 v24,14.86
NET_STATUS  (via drill 0.5)
  Top 0.254: v20.5,22.5 21,23 21,27.5 v20.5,28 | v17.14,38.39 16.86,38.67 16.86,41 16.86,41.1 Q9.1
  Bottom 0.254: v20.5,22.5 20.5,17.25 21,16.75 21.75,16.75 22.16,16.34 22.16,13.13 22.46,12.83 23.5,12.83 24.16,12.16 U1.6 | v20.5,28 20.5,36.53 18.64,38.39 v17.14,38.39
OE
  Top 0.305: R14.1 U9.10
PWRKEY  (via drill 0.35, 0.6)
  Top 0.254: R11.2 13.72,37 v12.5,37 12.5,38.68 10.03,41.15 8.31,41.15 7.46,42 7.46,44.32 v6.5,45.28
  Bottom 0.254: 4.03,20 U1.21 4.88,19.87 5.59,20.57 5.59,35.09 7,36.5 12,36.5 v12.5,37 | SW3.1 10.4,48 7.5,48 6.5,47 v6.5,45.28
  Bottom 0.305: C22.1 SW3.1
PWRKEY_MODULE  (via drill 0.5)
  Top 0.254: U2.30 38.51,24.49 39.5,23.5 39.5,20.69 35.15,20.69 31.5,17.05 31.5,16.52 24,9.02 v24,7 | v6.76,23.41 6.76,22.41 3.52,19.16 v2.34,19.16 | v13.64,9.67 13.64,13.28 v12.06,14.86 | v11.5,33.5 12.02,32.98 Q1.1 12.87,31.92 U$25.1
  Bottom 0.254: v11.5,33.5 7,33.5 6.51,33.01 6.51,23.66 v6.76,23.41 | v13.64,9.67 12.64,9.67 12,9.03 12,6.87 12.38,6.49 23.48,6.49 v24,7 | v12.06,14.86 6.35,14.86 5.21,13.72 3.05,13.72 2.29,14.48 2.29,19.11 v2.34,19.16
RESET_MODULE  (via drill 0.5)
  Top 0.254: v34.42,23.62 34.42,22.84 30.77,19.19 v30.23,19.19 | U2.10 37.24,42.33 36.56,41.65 36.56,30.47 34.42,28.33 v34.42,27.69 | U9.15 24.43,18.68 v25.32,17.79
  Bottom 0.254: v34.42,27.69 v34.42,23.62 | v30.23,19.19 30.23,17.69 29.85,17.32 25.79,17.32 v25.32,17.79
RESET_N  (via drill 0.5)
  Top 0.254: U9.6 11.68,18.68 v11,18
  Bottom 0.254: U1.20 5.66,18.57 6.96,17.27 10.27,17.27 v11,18
RX_CAMERA  (via drill 0.5)
  Top 0.254: U2.27 34.7,24.8 37.12,22.38 v37.12,21.99 | JP1.15 39.5,2.53 39.5,7.37 41.41,9.28 41.41,15.59 40,17 37.75,17 37.21,17.54 v37.21,18.04
  Bottom 0.254: v37.12,21.99 37.12,18.13 v37.21,18.04
RX_CELLULAR
  Top 0.305: U2.11 35.84,43.2 35.84,30.51 32.56,27.23 29.14,27.23 28.65,26.74 28.65,15.64 18.68,5.67 18.68,2.97 JP1.7
RX_ESP
  Top 0.254: U2.34 43.57,25.31 43.57,23.76 39.81,20 35.25,20 32,16.75 32,16.12 25.19,9.3 25.19,2.96 24.73,2.5 JP1.9
RX_MODULE2
  Top 0.254: JP1.4 15.5,6.47 15.5,8.5 19.5,12.5 19.5,19 20.48,19.98 U9.17
RXD_MODULE  (via drill 0.5)
  Top 0.254: v15.24,20.32 15.59,19.98 U9.4
  Bottom 0.254: U1.68 30.11,22.47 29.35,23.23 16.5,23.23 15.24,21.97 v15.24,20.32
TRAP_CHECK  (via drill 0.5)
  Top 0.254: v34,16.5 34.12,16.38 39.62,16.38 40.75,15.25 40.75,9.75
  Top 0.305: U$29.2 | U$29.2 33.45,43.35 U2.13 33.43,39.57 v34,39 | 40.75,9.75 37,6 37,2.57 JP1.14
  Bottom 0.305: v34,39 34,38 34.5,37.5 34.5,32.5 33.5,31.5 33.5,17 v34,16.5
TRAP_FORCE  (via drill 0.5)
  Top 0.254: SW4.1 6.05,43.55 C23.1 5.96,41.91 U$31.2 6.46,40.01 v8.99,40.01 | U2.7 41.05,41.55 40,40.5 39.38,40.5 v38.25,41.63
  Bottom 0.254: v38.25,41.63 37.41,40.79 9.77,40.79 v8.99,40.01
TX_CAMERA  (via drill 0.5)
  Top 0.254: U2.28 35.97,24.53 37,23.5 38,23.5 v38.5,23 | JP1.16 42.01,15.99 39.99,18.01 v38.51,18.01
  Bottom 0.254: v38.5,23 38.5,18.03 v38.51,18.01
TX_CELLULAR
  Top 0.305: U2.12 34.7,42.33 35.2,41.83 35.2,30.7 32.25,27.75 28.75,27.75 28.12,27.12 28.12,16.01 16.64,4.53 16.64,2.53 JP1.6
TX_ESP
  Top 0.254: U2.35 44.86,24.16 40.03,19.33 35.5,19.33 32.5,16.33 32.5,15.61 26.76,9.87 26.76,2.51 JP1.10
TX_MODULE2
  Top 0.152: U9.16 22.4,19.36 22.35,19.3
  Top 0.254: JP1.5 14.07,4 16.07,6 16.07,8.07 20,12 20,18.6 20.7,19.3 22.35,19.3
TXD_MODULE  (via drill 0.5)
  Top 0.254: U9.5 12.04,19.32 v11.26,20.1
  Bottom 0.254: U1.67 12.27,23.77 11.25,22.75 11.25,20.11 v11.26,20.1
USIM_CLK
  Bottom 0.254: U1.16 8.06,5.94 9,5 29.96,5 31.93,6.96 33.07,6.96 34.8,5.24 R5.2
  Bottom 0.305: 8.13,11.35 U1.16
USIM_DATA
  Bottom 0.254: U1.15 9.36,5.64 9.5,5.5 29.5,5.5 32.5,8.5 33.86,8.5 R3.1
USIM_GND
  Bottom 0.508: C10.1 46,22.5 43.99,24.51 43.98,24.5 37.5,24.5 35.7,22.7 U$7.GND 35.7,16 34.08,14.38 34.08,11.84 30.75,8.51 C11.2 29.37,8.52 17.74,8.52 15.86,10.39 U1.10
USIM_RST  (via drill 0.5)
  Top 0.305: v32.5,6 36,6 39.5,9.5 v39.5,15
  Bottom 0.254: U1.17 6.76,6.24 8.5,4.5 31,4.5 v32.5,6
  Bottom 0.305: R4.2 40.74,22.24 39.5,21 v39.5,15
USIM_VDD  (via drill 0.5)
  Top 0.254: v42,18 44.03,20.03 v46,20.03
  Bottom 0.254: D8.1 44.89,21.16 C10.2 | C10.2 47.43,21.16 | R6.2 U$7.VCC | U1.14 10.66,6.34 11,6 29.24,6 34.8,11.56 34.8,12.21 35.28,12.7 39.7,12.7 42,15 v42,18 | v46,20.03 C10.2
  Bottom 0.305: 47.43,21.16 R6.2
VBAT  (via drill 0.5)
  Top 0.254: JP1.3 10.99,4.5 12.47,4.5 14.99,7.02 14.99,8.99 19,13 19,23.5 16.25,26.25 16.25,30.59 15.92,30.92 | 10.5,30.86 10.5,34 11,34.5 11,37.9 10.09,38.8 4.09,38.8 TP20.T
  Top 0.508: v28,37.61 27.11,37.61 23,33.5 18.5,33.5 15.92,30.92 15.86,30.86 10.5,30.86 5.75,30.86 4.96,31.65 Q8.3
  Bottom 0.508: 33,35.5 33.44,35.69 33.44,36.5 33.17,36.77 U1.57 30.22,36.77 29.38,37.61 v28,37.61 | 33,35.5 U1.58 | 33,35.5 33.44,35.06 33.44,34.5 33.02,34.16 | 33.02,34.16 U1.59 | 33.02,34.16 33.4,33.78 33.4,33.15 33.15,32.89 U1.60
VDD_1V8  (via drill 0.5)
  Top 0.254: v15.24,27.05 15.24,25.34 14.39,24.48 U11.2 14.39,22.56 C21.1 | TP8.T 18.5,28.11 18.5,27.13 v18.25,26.87 | C13.2 arc-90 C13.2 C21.1 | C21.1 15.67,21.27 U9.2
  Top 0.305: U11.2
  Bottom 0.254: v18.25,26.87 18.17,26.8 15.49,26.8 v15.24,27.05
VDD_3V3  (via drill 0.5)  (1 unrouted)
  Top 0.152: 47.55,43.13 U2.2
  Top 0.254: R2.1 32.13,21.49 32.12,21.5 31.44,20.82 v30.23,20.82 | v25.28,20.32 25.09,20.32 24.2,21.22 C20.1 | 20.7,37 U3.4 17.8,36.7 16.41,38.08 16.41,38.09 16,38.5 13.5,38.5 10.34,41.66 8.64,41.66 8,42.29 8,46.27 6.87,47.4 SW4.2
  Top 0.305: D4.+ 19.81,43.24 | D5.+ 23.5,43.31 23.5,43.25 | 23.5,43.25 23.5,43.24 19.81,43.24 | U3.4 19.81,37.89 19.81,43.24 | 23.5,43.25 26.75,43.25 27.5,44 D7.+ | U3.2 21,29 21.5,28.5 21.5,24.46 24.09,21.87 C20.1 22.43,21.22 U9.19
  Top 0.508: U3.4 24.2,36.7 26.5,39 26.5,40 29.5,43 29.5,45.5 31.5,47.5 v35,47.5 | U$24.1 45.96,46.47 C2.1 45.06,45.88 44.9,45.72 43,45.72 | U$24.1 46.65,46.47 C3.1 | U$24.1 47.03,46.47 47.5,46 47.5,43.43 U2.2 | v39.88,45.72 43,45.72 | C18.+ 43.12,45.84 43,45.72
  Bottom 0.254: v30.23,20.82 29.73,20.32 v25.28,20.32
  Bottom 0.508: v35,47.5 38.1,47.5 v39.88,45.72
VDD_EXT  (via drill 0.35)
  Top 0.152: R14.2 15.09,15.09
  Top 0.254: 15.09,15.09 16.08,14.1 v16.08,12.91
  Bottom 0.152: U1.7
  Bottom 0.254: U1.7 21.37,12.91 v16.08,12.91
VSYS
  Top 0.254: Q8.2 4.07,35.49 R8.2
  Top 0.508: J2.1 | C12.2 12.74,26.78 U11.3
  Top 0.61: J2.1 8.4,14.1 9.67,15.37 9.67,19.42 C16.1 9.74,20 10.74,21 10.74,25.94 C15.+ | C12.2 C15.+ | C15.+ 6,28 2.5,31.5 2.5,33 3.61,34.11 Q8.2